# EAGLE design TouScrino-v1 (EAGLE 5.07)
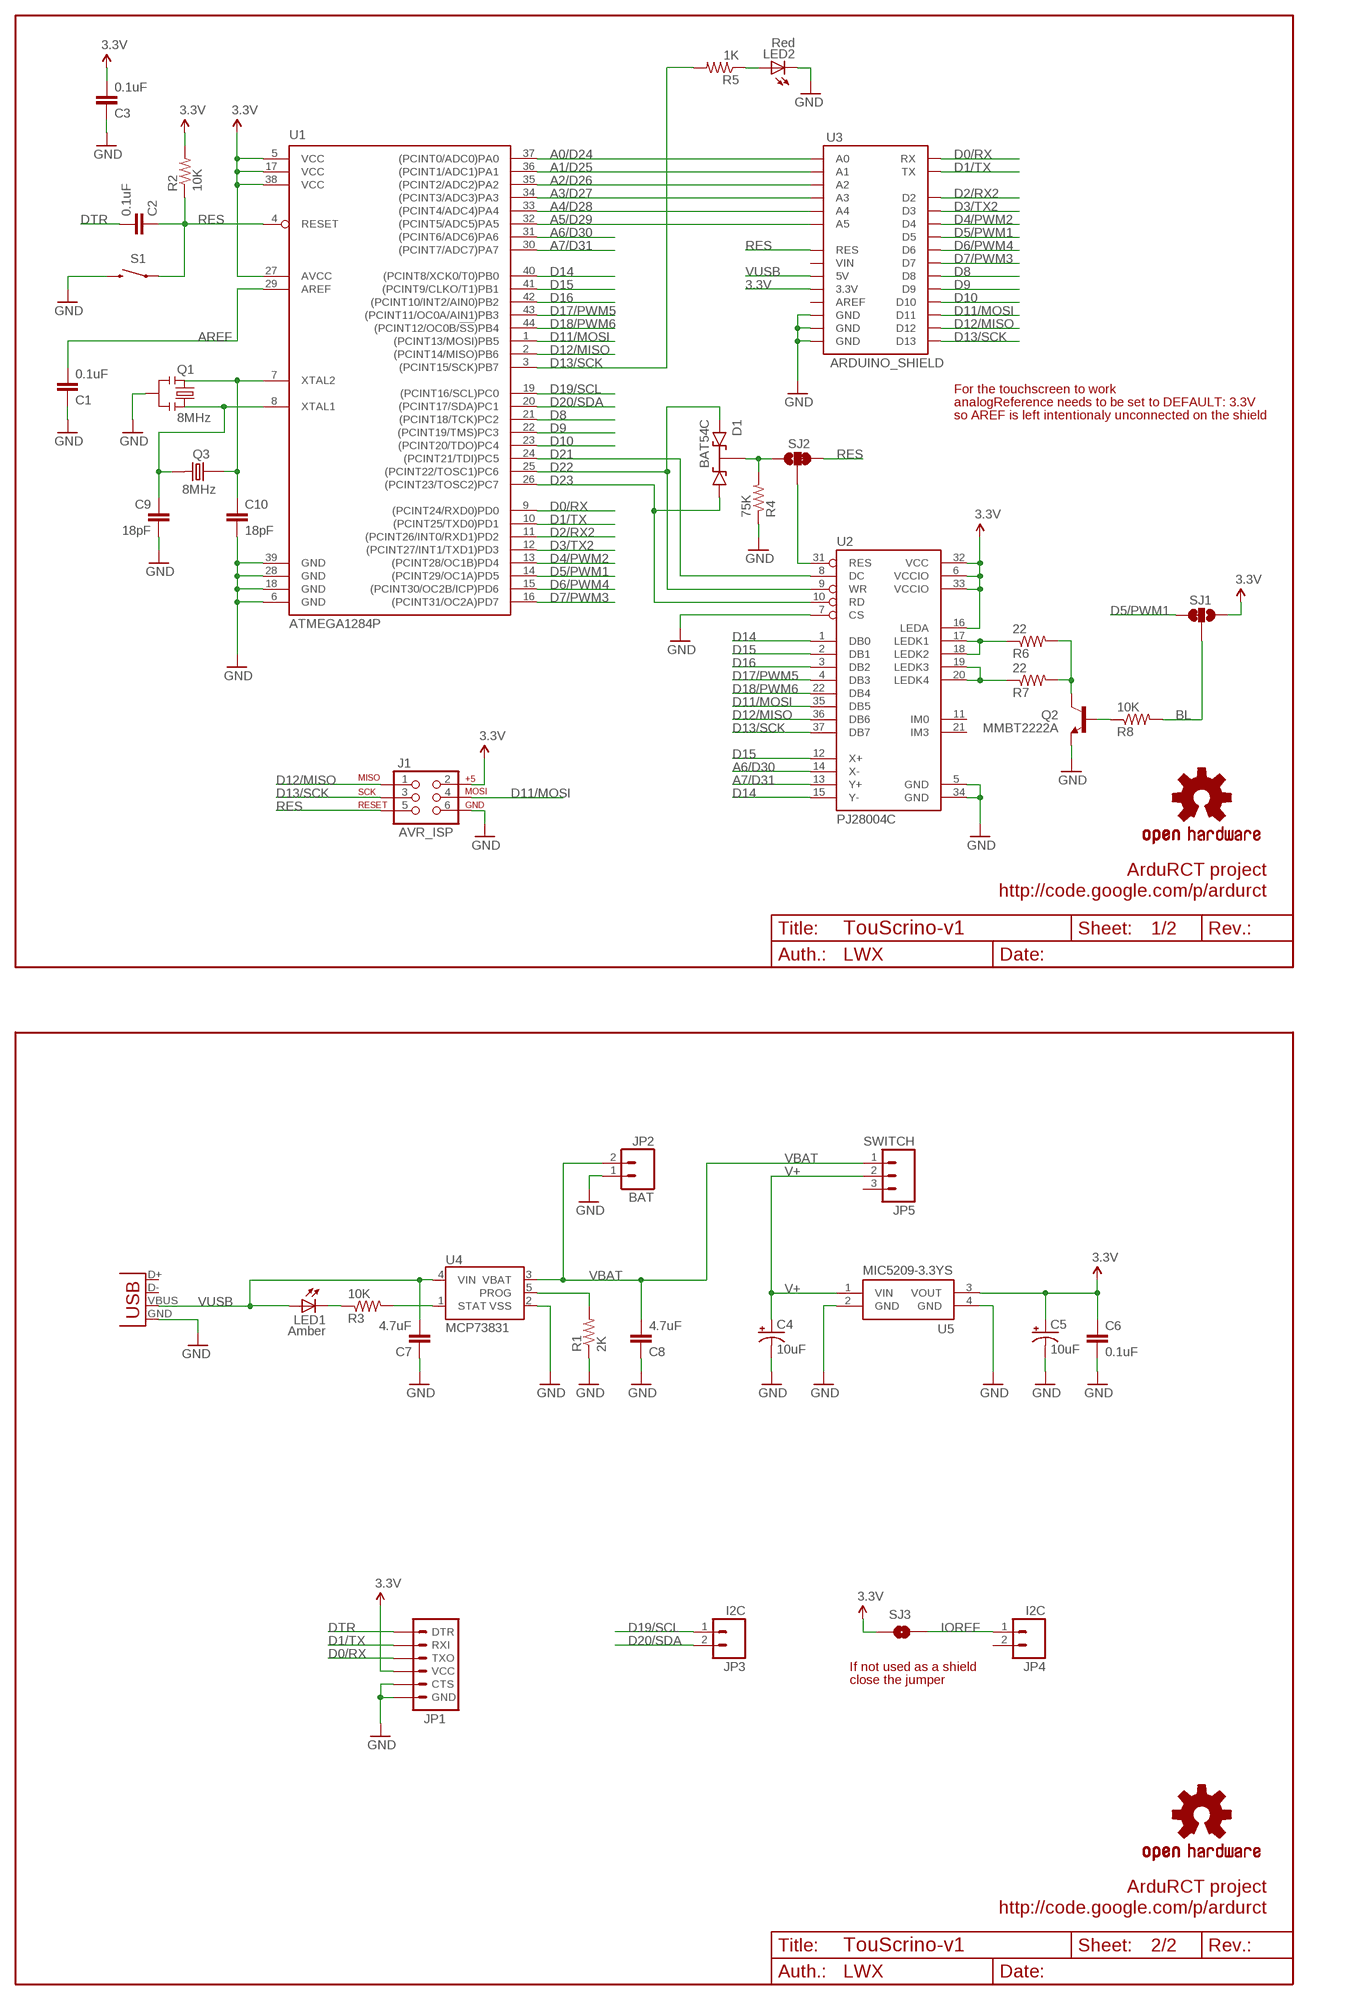
[diagram p0: schematic, sheet 1]

## Parts
C1  0.1uF  CAP0805  [0805]
C2  0.1uF  CAP0805  [0805]
C3  0.1uF  CAP0805  [0805]
C4  10uF  CAP_POL1206  [EIA3216]
C5  10uF  CAP_POL1206  [EIA3216]
C6  0.1uF  CAP0805  [0805]
C7  4.7uF  CAP0805  [0805]
C8  4.7uF  CAP0805  [0805]
C9  18pF  CAP0603-CAP  [0603-CAP]
C10  18pF  CAP0603-CAP  [0603-CAP]
D1  BAT54C  [SOT23-3]
J1  AVR_ISP  AVR_SPI_PRG_6PTH  [2X3]
JP1  ARDUINO_SERIAL_PROGRAMPTH  [1X06]
JP2  BAT  M02-JST-2MM-SMT  [JST-2-SMD]
JP3  I2C  M02  [1X02]
JP4  I2C  M02  [1X02]
JP5  SWITCH  M03  [1X3_LONGPAD]
LED1  Amber  LED  [LED]
LED2  Red  LED805  [LED-0805]
Q1  8MHz  RESONATORSMD  [RESONATOR-SMD]
Q2  MMBT2222A  TRANSISTOR_NPNSOT23-3  [SOT23-3]
Q3  8MHz  CRYSTAL_5X3.2  [CRYSTAL_5X3.2]
R1  2K  RESISTOR0805-RES  [0805]
R2  10K  RESISTOR0805-RES  [0805]
R3  10K  RESISTOR0805-RES  [0805]
R4  75K  RESISTOR0805-RES  [0805]
R5  1K  RESISTOR0805-RES  [0805]
R6  22  RESISTOR0805-RES  [0805]
R7  22  RESISTOR0805-RES  [0805]
R8  10K  RESISTOR0805-RES  [0805]
S1  SWITCH-MOMENTARY-2SMD  [TACTILE_SWITCH_SMD]
SJ1  SJ_2WAYS_1-2  [SJ_2WAYS_1-2_S]
SJ2  SJ_2WAYS_1-2  [SJ_2WAYS_1-2_S]
SJ3  SOLDERJUMPERNO  [SJ_2S-NO]
U1  ATMEGA1284P  ATMEGA324A  [TQFP44]
U2  PJ28004C  [PJ28004C]
U3  ARDUINO_SHIELD  [ARDUINO_SHIELD]
U4  MCP73831  [SOT23-5]
U5  MIC5209-3.3YS  MIC5209  [SOT223]
U$3  OSHW-LOGOM  [OSHW-LOGO-M]
U$5  OSHW-LOGOM  [OSHW-LOGO-M]
X1  USBSMD  [USB-MINIB]

## Nets
3.3V: C3.2 C5.A(+) C6.1 J1.2 JP1.4(VCC) R2.2 SJ1.3 SJ3.1 U1.5(VCC) U1.17(VCC) U1.27(AVCC) U1.38(VCC) U2.6(VCCIO) U2.16(LEDA) U2.32(VCC) U2.33(VCCIO) U3.3.3V U5.3(VOUT)
A0/D24: U1.37((PCINT0/ADC0)PA0) U3.A0
A1/D25: U1.36((PCINT1/ADC1)PA1) U3.A1
A2/D26: U1.35((PCINT2/ADC2)PA2) U3.A2
A3/D27: U1.34((PCINT3/ADC3)PA3) U3.A3
A4/D28: U1.33((PCINT4/ADC4)PA4) U3.A4
A5/D29: U1.32((PCINT5/ADC5)PA5) U3.A5
A6/D30: U1.31((PCINT6/ADC6)PA6) U2.14(X-)
A7/D31: U1.30((PCINT7/ADC7)PA7) U2.13(Y+)
AREF: C1.2 U1.29(AREF)
BL: R8.2 SJ1.2
D0/RX: JP1.3(TXO) U1.9((PCINT24/RXD0)PD0) U3.RX
D1/TX: JP1.2(RXI) U1.10((PCINT25/TXD0)PD1) U3.TX
D2/RX2: U1.11((PCINT26/INT0/RXD1)PD2) U3.D2
D3/TX2: U1.12((PCINT27/INT1/TXD1)PD3) U3.D3
D4/PWM2: U1.13((PCINT28/OC1B)PD4) U3.D4
D5/PWM1: SJ1.1 U1.14((PCINT29/OC1A)PD5) U3.D5
D6/PWM4: U1.15((PCINT30/OC2B/ICP)PD6) U3.D6
D7/PWM3: U1.16((PCINT31/OC2A)PD7) U3.D7
D8: U1.21((PCINT18/TCK)PC2) U3.D8
D9: U1.22((PCINT19/TMS)PC3) U3.D9
D10: U1.23((PCINT20/TDO)PC4) U3.D10
D11/MOSI: J1.4 U1.1((PCINT13/MOSI)PB5) U2.35(DB5) U3.D11
D12/MISO: J1.1 U1.2((PCINT14/MISO)PB6) U2.36(DB6) U3.D12
D13/SCK: J1.3 R5.2 U1.3((PCINT15/SCK)PB7) U2.37(DB7) U3.D13
D14: U1.40((PCINT8/XCK0/T0)PB0) U2.1(DB0) U2.15(Y-)
D15: U1.41((PCINT9/CLKO/T1)PB1) U2.2(DB1) U2.12(X+)
D16: U1.42((PCINT10/INT2/AIN0)PB2) U2.3(DB2)
D17/PWM5: U1.43((PCINT11/OC0A/AIN1)PB3) U2.4(DB3)
D18/PWM6: U1.44((PCINT12/OC0B/!SS!)PB4) U2.22(DB4)
D19/SCL: JP3.1 U1.19((PCINT16/SCL)PC0)
D20/SDA: JP3.2 U1.20((PCINT17/SDA)PC1)
D21: U1.24((PCINT21/TDI)PC5) U2.8(DC)
D22: D1.2(A2) U1.25((PCINT22/TOSC1)PC6) U2.9(WR)
D23: D1.1(A1) U1.26((PCINT23/TOSC2)PC7) U2.10(RD)
DTR: C2.2 JP1.1(DTR)
GND [vcc]: C1.1 C3.1 C4.C(-) C5.C(-) C6.2 C7.1 C8.1 C9.2 C10.2 J1.6 JP1.5(CTS) JP1.6(GND) JP2.1 LED2.2(C) Q1.2 Q2.2(E) R1.1 R4.1 S1.3 U1.6(GND) U1.18(GND) U1.28(GND) U1.39(GND) U2.5(GND) U2.7(CS) U2.34(GND) U3.GND@0(GND) U3.GND@1(GND) U3.GND@2(GND) U4.2(VSS) U5.2(GND) U5.4(GND) X1.GND
IOREF: JP4.1 SJ3.2
LCD_RES: SJ2.2 U2.31(RES)
N$1: C9.1 Q1.1 Q3.2 U1.8(XTAL1)
N$2: C10.1 Q1.3 Q3.1 U1.7(XTAL2)
N$4: Q2.1(B) R8.1
N$5: LED2.1(A) R5.1
N$7: Q2.3(C) R6.2 R7.2
N$8: LED1.C1(C) R3.1
N$9: D1.3(K) R4.2 SJ2.3
N$12: R3.2 U4.1(STAT)
N$13: R1.2 U4.5(PROG)
N$25: R7.1 U2.19(LEDK3) U2.20(LEDK4)
N$32: R6.1 U2.17(LEDK1) U2.18(LEDK2)
RES: C2.1 J1.5 R2.1 S1.1 SJ2.1 U1.4(RESET) U3.RES
V+: C4.A(+) JP5.2 U5.1(VIN)
VBAT: C8.2 JP2.2 JP5.1 U4.3(VBAT)
VUSB: C7.2 LED1.A1(A) U3.5V U4.4(VIN) X1.VBUS
Unconnected: JP4.2 JP5.3 U2.11(IM0) U2.21(IM3) U3.AREF U3.VIN X1.D+ X1.D-

## Notes on the sheet
- For the touchscreen to work
- analogReference needs to be set to DEFAULT: 3.3V
- so AREF is left intentionaly unconnected on the shield
- ArduRCT project
- http://code.google.com/p/ardurct
- 1/2
- LWX
- If not used as a shield
- close the jumper
- ArduRCT project
- http://code.google.com/p/ardurct
- 2/2
- LWX

## Library data of the parts
C1-C3 C6-C10 = SparkFun:CAP: Capacitor Standard 0603 ceramic capacitor, and 0.1" leaded capacitor.
C4 C5 = SparkFun:CAP_POL: Capacitor Polarized These are standard SMD and PTH capacitors. Normally 10uF, 47uF, and 100uF in electrolytic and tantalum varieties. Always verify the external diameter of the through hole cap, it varies with capacity, voltage, and manufacturer. The EIA devices should be standard.
D1 = wibauxl:BAT54C
J1 = SparkFun:AVR_SPI_PRG_6: AVR ISP 6 Pin This is the reduced ISP connector for AVR programming. Common on Arduino. This footprint will take up less PCB space and can be used with a 10-pin to 6-pin adapter such as SKU: BOB-08508
JP1 = SparkFun:ARDUINO_SERIAL_PROGRAM
JP2 = SparkFun:M02: Header 2 Standard 2-pin 0.1" header. Use with straight break away headers (SKU : PRT-00116), right angle break away headers (PRT-00553), swiss pins (PRT-00743), machine pins (PRT-00117), and female headers (PRT-00115). Molex polarized connector foot print use with SKU : PRT-08233 with associated crimp pins and housings.
JP3 JP4 = wibauxl:M02
JP5 = wibauxl:M03
LED1 LED2 = wibauxl:LED
Q1 = SparkFun:RESONATOR: Resonator Small SMD resonator. This is the itty bitty 10/20MHz resonators with built in caps. CSTCE10M0G55 and CSTCE20M0V53. Footprint has been reviewed closely but hasn't been tested yet.
Q2 = SparkFun:TRANSISTOR_NPN: Transistor NPN BJT configuration in SOT23 package. MMBT2222 is the common NPN we use. Double check BCE configuration again layout.
Q3 = wibauxl:CRYSTAL_5X3.2
R1-R8 = SparkFun:RESISTOR: Resistor Basic schematic elements and footprints for 0603, 1206, and PTH resistors.
S1 = SparkFun:SWITCH-MOMENTARY-2
SJ1 SJ2 = wibauxl:SJ_2WAYS_1-2
SJ3 = SparkFun:SOLDERJUMPER: Solder Jumper Standard SMD solder jumper. Used to automate production. Two varients : Normally Open and Normally Closed are the same, but have different paste layers. NC will have a large amount of paste and should jumper during reflow.
U1 = wibauxl:ATMEGA324: 8-bit Microcontroller with 64K Bytes In-System Programmable Flash Source: http://www.atmel.com/dyn/resources/prod_documents/doc2593.pdf
U2 = wibauxl:PJ28004C
U3 = wibauxl:ARDUINO_SHIELD
U4 = SparkFun:MCP73831: Microchip's MCP73831 Miniature single cell, fully integrated Li-Ion, Li-polymer charge management controller http://ww1.microchip.com/downloads/en/DeviceDoc/21984a.pdf
U5 = wibauxl:MIC5209
U$3 U$5 = SparkFun:OSHW-LOGO: Open Source Hardware Logo This logo indicates the piece of hardware it is found on incorporates a OSHW license and/or adheres to the definition of open source hardware found here: http://freedomdefined.org/OSHW
X1 = SparkFun:USB: USB Connectors USB-B-PTH is fully proven SKU : PRT-00139 USB-miniB is fully proven SKU : PRT-00587 USB-A-PCB is untested. USB-A-H is throughly reviewed, but untested. Spark Fun Electronics SKU : PRT-00437 USB-B-SMT is throughly reviewed, but untested. Needs silkscreen touching up. USB-A-S has not been used/tested USB-MB-H has not been used/tested

## Net classes
0 default: width 0.203 mm
1 vcc: width 0.254 mm

## Board
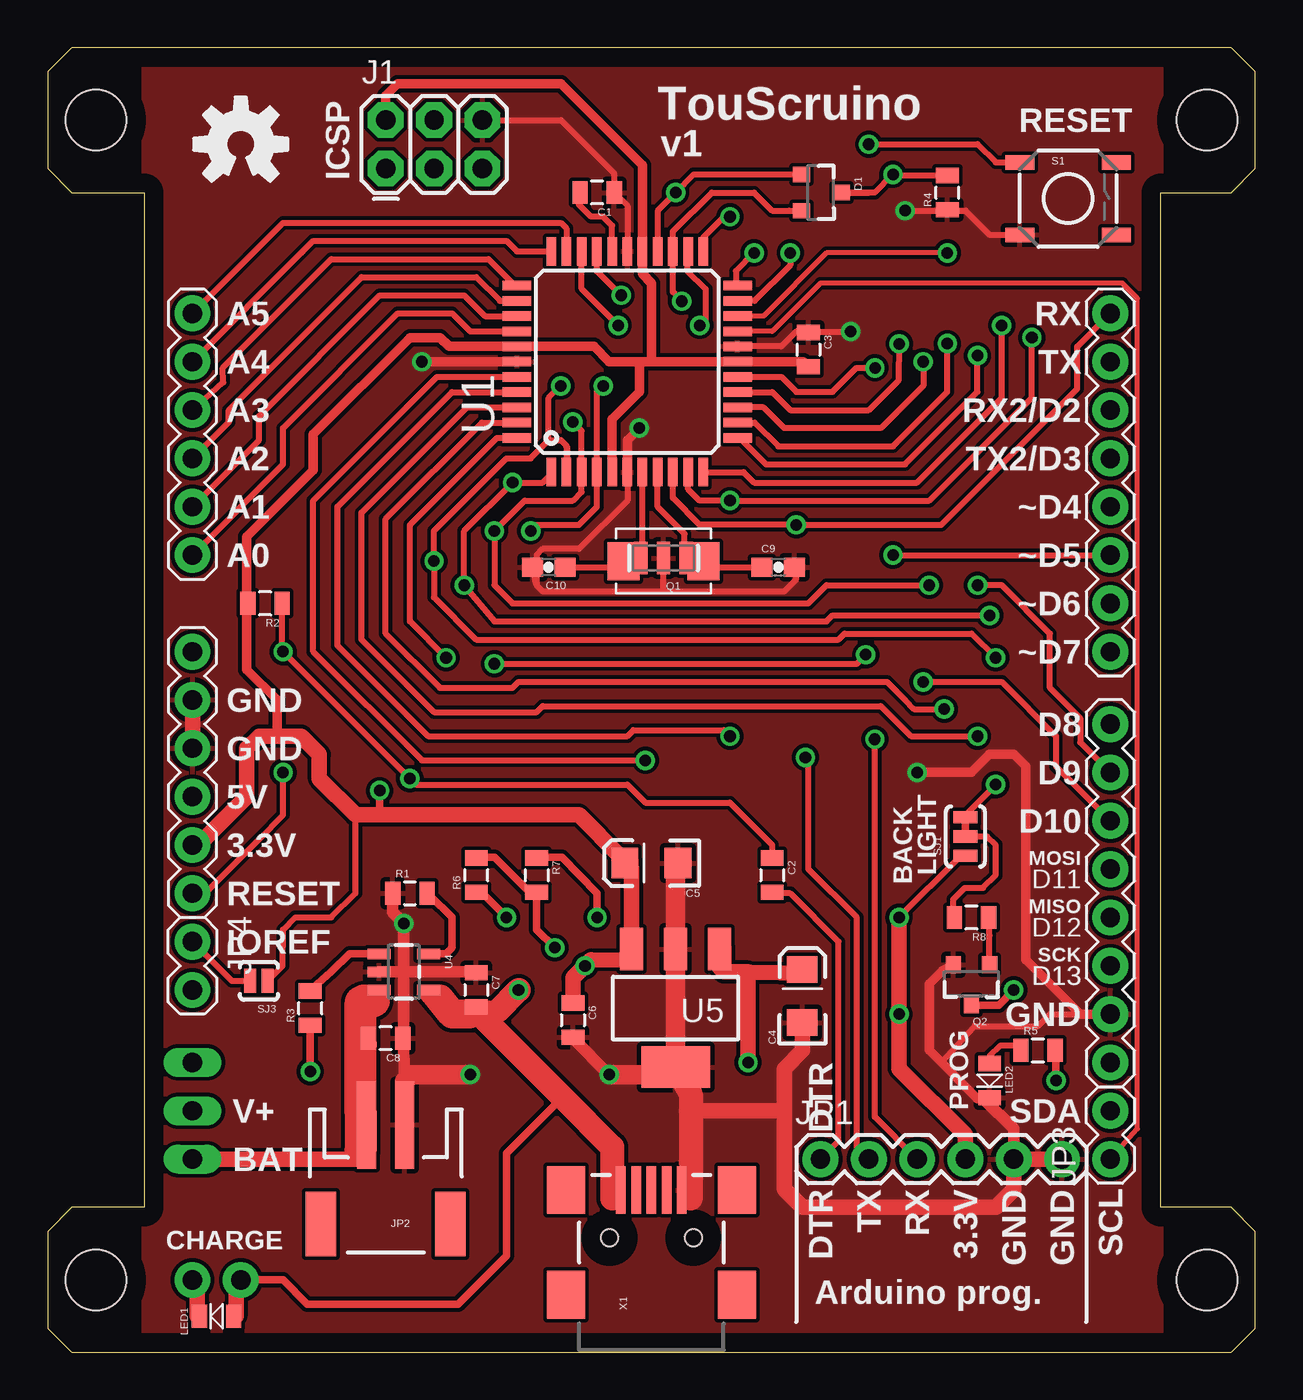
[diagram p1: board, top side]
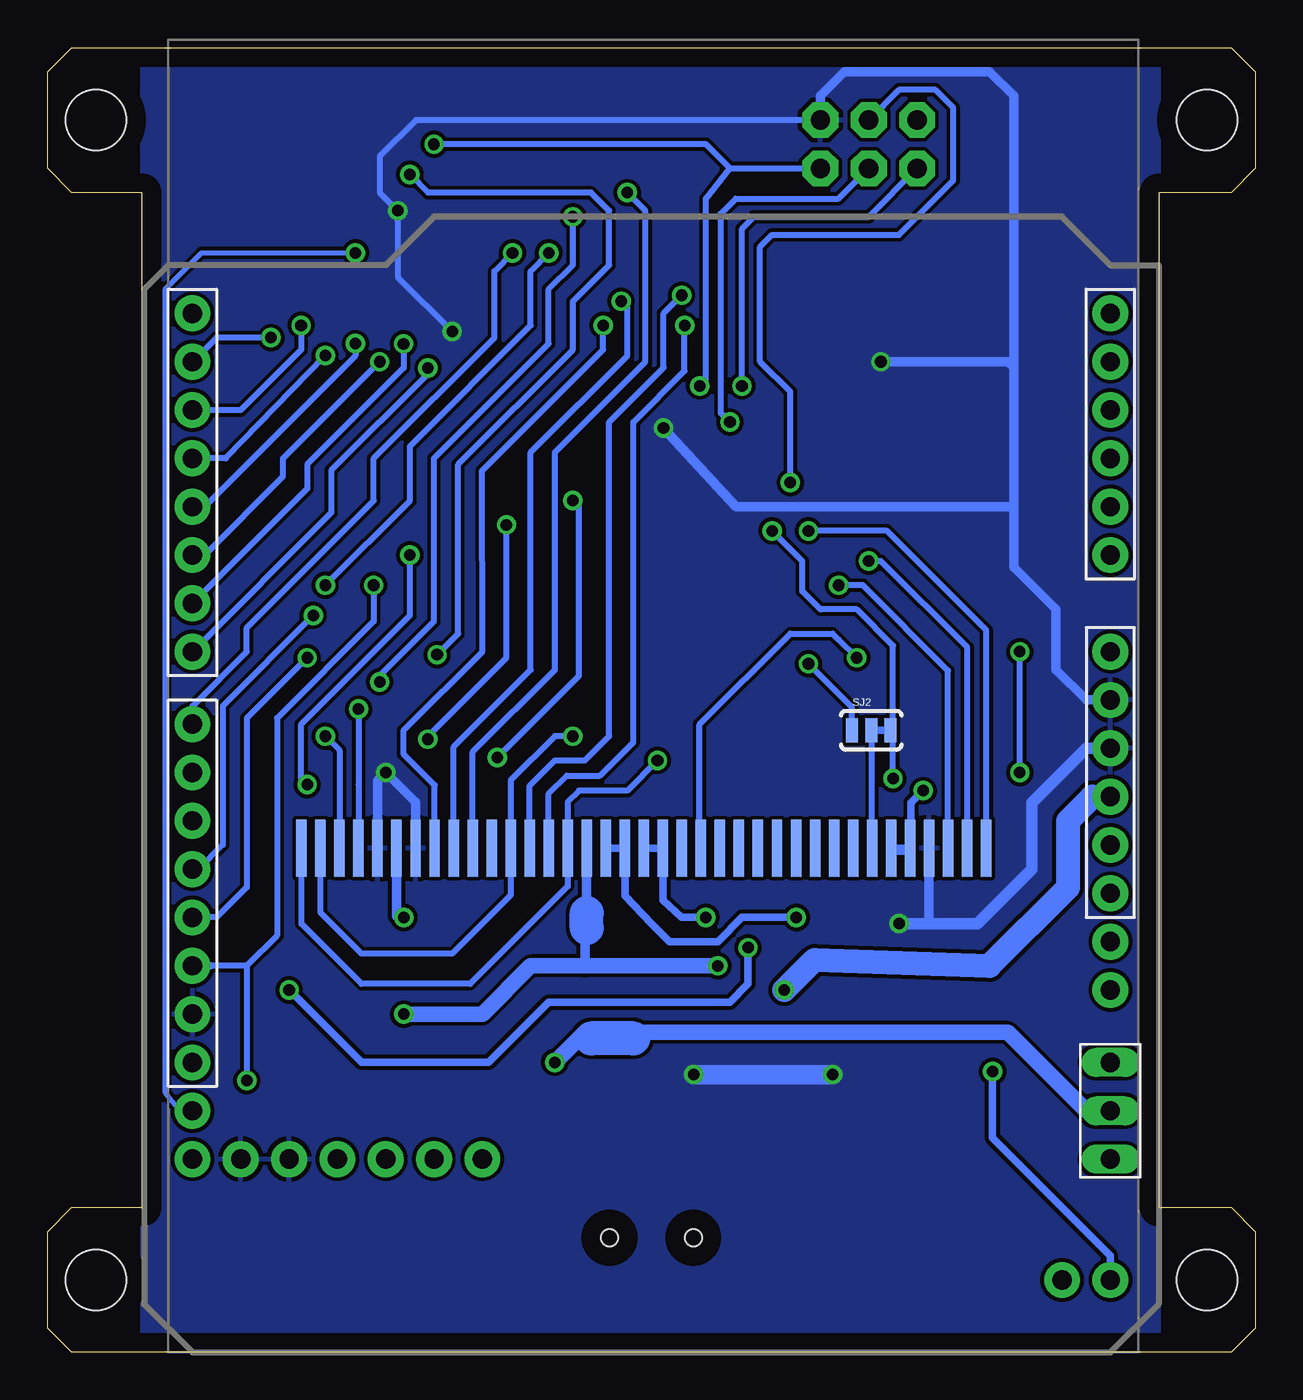
[diagram p2: board, bottom side, seen from below]

Size 63.5 x 68.58 mm. Coordinates in mm from the lower left corner, seen from the top.
Outline: 63.5,1.27 63.5,6.35 62.23,7.62 58.52,7.62 58.52,60.96 62.23,60.96 63.5,62.23 63.5,67.31 62.23,68.58 1.27,68.58 0,67.31 0,62.23 1.27,60.96 5.08,60.96 5.08,7.62 1.27,7.62 0,6.35 0,1.27 1.27,0 62.23,0 63.5,1.27
Copper layers (1*16): Top 0.035mm / dielectric 1.5mm / Bottom 0.035mm
Design rules "default": minimum track width 10mil, minimum drill 24mil, track to track 8mil, track to pad 8mil, pad to pad 8mil, via to via 8mil, smd to smd 8mil, copper to edge 40mil, drill to drill 8mil, minimum pad ring 10mil, minimum via ring 8mil, stop-mask expansion 4mil, vias tented up to drill 0mil, thermal gap 10mil
Holes 3.2 mm at 2.54,64.77 60.96,64.77 2.54,3.81 60.96,3.81

### Footprints (pad centres in the part's own frame; a part is rotated, then mirrored left to right if it is on the bottom)
0805 = smd 0.8 x 1.2: 1 -0.9,0; 2 0.9,0
EIA3216 = smd 1.4 x 1.6: A 1.4,0; C -1.4,0
0603-CAP = smd 1.1 x 1: 1 -0.85,0; 2 0.85,0
SOT23-3 = smd 0.8 x 0.9: 1 -0.95,-1; 2 0.95,-1; 3 0,1.1
2X3 = drill 1.016 pad 1.88 octagon: 1 0,0; 2 0,2.54; 3 2.54,0; 4 2.54,2.54; 5 5.08,0; 6 5.08,2.54
1X06 = drill 1.016 pad 1.88 round: 1 0,0; 2 2.54,0; 3 5.08,0; 4 7.62,0; 5 10.16,0; 6 12.7,0
JST-2-SMD = smd 1 x 4.6: 1 -1,-3.7; 2 1,-3.7 | smd 1.6 x 3.4: NC1 -3.4,1.5; NC2 3.4,1.5
1X02 = drill 1.016 pad 1.88 round: 1 0,0; 2 2.54,0
1X3_LONGPAD = drill 1.016 pad 1.245 long: 1 0,0; 2 -2.54,0; 3 -5.08,0
LED = smd 0.8 x 1.2: A -0.9,0; C 0.9,0 | drill 1.016 pad 1.88 round: A1 -1.27,-1.905; C1 1.27,-1.905
LED-0805 = smd 0.8 x 1.2: 1 -0.9,0; 2 0.9,0
RESONATOR-SMD = smd 0.7 x 1.7: 1 -1.2,0; 2 0,0; 3 1.2,0
CRYSTAL_5X3.2 = smd 1.7 x 2: 1 2.1,0; 2 -2.1,0
TACTILE_SWITCH_SMD = smd 1.524 x 0.762: 1 -2.54,1.905; 2 2.54,1.905; 3 -2.54,-1.905; 4 2.54,-1.905
SJ_2WAYS_1-2_S = smd 0.635 x 1.27: 1 0.508,0; 2 -0.508,0; 3 -1.524,0
SJ_2S-NO = smd 0.635 x 1.27: 1 -0.45,0; 2 0.45,0
TQFP44 = smd 1.5 x 0.5: 1 -5.8,4; 2 -5.8,3.2; 3 -5.8,2.4; 4 -5.8,1.6; 5 -5.8,0.8; 6 -5.8,0; 7 -5.8,-0.8; 8 -5.8,-1.6; 9 -5.8,-2.4; 10 -5.8,-3.2; 11 -5.8,-4; 23 5.8,-4; 24 5.8,-3.2; 25 5.8,-2.4; 26 5.8,-1.6; 27 5.8,-0.8; 28 5.8,0; 29 5.8,0.8; 30 5.8,1.6; 31 5.8,2.4; 32 5.8,3.2; 33 5.8,4 | smd 0.5 x 1.5: 12 -4,-5.8; 13 -3.2,-5.8; 14 -2.4,-5.8; 15 -1.6,-5.8; 16 -0.8,-5.8; 17 0,-5.8; 18 0.8,-5.8; 19 1.6,-5.8; 20 2.4,-5.8; 21 3.2,-5.8; 22 4,-5.8; 34 4,5.8; 35 3.2,5.8; 36 2.4,5.8; 37 1.6,5.8; 38 0.8,5.8; 39 0,5.8; 40 -0.8,5.8; 41 -1.6,5.8; 42 -2.4,5.8; 43 -3.2,5.8; 44 -4,5.8
PJ28004C = smd 0.55 x 3: 1 7,26.5; 2 8,26.5; 3 9,26.5; 4 10,26.5; 5 11,26.5; 6 12,26.5; 7 13,26.5; 8 14,26.5; 9 15,26.5; 10 16,26.5; 11 17,26.5; 12 18,26.5; 13 19,26.5; 14 20,26.5; 15 21,26.5; 16 22,26.5; 17 23,26.5; 18 24,26.5; 19 25,26.5; 20 26,26.5; 21 27,26.5; 22 28,26.5; 23 29,26.5; 24 30,26.5; 25 31,26.5; 26 32,26.5; 27 33,26.5; 28 34,26.5; 29 35,26.5; 30 36,26.5; 31 37,26.5; 32 38,26.5; 33 39,26.5; 34 40,26.5; 35 41,26.5; 36 42,26.5; 37 43,26.5
ARDUINO_SHIELD = drill 1.016 pad 1.88 round: 3.3V 33.02,50.8; 5V 30.48,50.8; A0 17.78,50.8; A1 15.24,50.8; A2 12.7,50.8; A3 10.16,50.8; A4 7.62,50.8; A5 5.08,50.8; AREF 44.45,2.54; D2 10.16,2.54; D3 12.7,2.54; D4 15.24,2.54; D5 17.78,2.54; D6 20.32,2.54; D7 22.86,2.54; D8 26.67,2.54; D9 29.21,2.54; D10 31.75,2.54; D11 34.29,2.54; D12 36.83,2.54; D13 39.37,2.54; GND@0 27.94,50.8; GND@1 25.4,50.8; GND@2 41.91,2.54; RES 35.56,50.8; RX 5.08,2.54; TX 7.62,2.54; VIN 22.86,50.8
SOT23-5 = smd 0.55 x 1.2: 1 -0.95,-1.3; 2 0,-1.3; 3 0.95,-1.3; 4 0.95,1.3; 5 -0.95,1.3
SOT223 = smd 1.219 x 2.235: 1 -2.311,-3.099; 2 0,-3.099; 3 2.311,-3.099 | smd 3.6 x 2.2: 4 0,3.099
USB-MINIB = smd 2.5 x 0.5: D+ 2.5,0; D- 2.5,0.8; GND 2.5,-1.6; ID 2.5,-0.8; VBUS 2.5,1.6 | smd 2.5 x 2: MTN1 -3,4.5; MTN2 2.5,4.5; MTN3 -3,-4.5; MTN4 2.5,-4.5 | hole 0.9: 0,2.2; 0,-2.2

### Placement (x,y rotation side)
C1  28.89,60.96 180 top
C2  38.1,25.08 270 top
C3  40.01,52.7 270 top
C4  39.69,18.73 90 top
C5  31.75,25.72 180 top
C6  27.62,17.46 270 top
C7  22.54,19.05 270 top
C8  17.78,16.51 180 top
C9  38.42,41.27 0 top
C10  26.35,41.27 180 top
D1  40.64,60.96 270 top
J1  17.78,62.23 0 top
JP1  40.64,10.16 0 top
JP2  17.78,8.26 180 top
JP3  55.88,10.16 90 top
JP4  7.62,21.59 270 top
JP5  7.62,10.16 270 bottom
LED1  8.89,1.91 180 top
LED2  49.53,14.29 270 top
Q1  32.38,41.75 180 top
Q2  48.58,19.37 180 top
Q3  32.38,41.59 180 top
R1  19.05,24.13 0 top
R2  11.43,39.37 180 top
R3  13.81,18.1 90 top
R4  47.31,60.96 90 top
R5  52.07,15.88 0 top
R6  22.54,25.08 90 top
R7  25.72,25.08 270 top
R8  48.58,22.86 180 top
S1  53.66,60.64 0 top
SJ1  48.26,27.62 90 top
SJ2  19.68,32.7 0 bottom
SJ3  11.11,19.53 180 top
U1  30.48,52.07 90 top
U2  57.15,0 0 bottom
U3  58.42,59.69 270 bottom
U4  18.73,20 270 top
U5  33.02,18.1 180 top
U$3  10.16,63.5 0 top
U$5  10.16,63.5 0 top
X1  31.75,6.03 90 top

### Tracks (layer width: path | path; a pad name or v marks a point on that pad's centre or on a via)
3.3V  (via drill 0.61)
  Top 0.305: 39.74,52.07 C3.2 | 31.28,61.91 31.33,61.86 | 31.28,61.43 31.28,62.23 | v44.77,22.86 47.94,26.04 | 10.48,39.37 R2.2 | 16.19,28.26 16.19,24.13 14.92,22.86 13.02,22.86 12.38,22.23 12.36,20.32 SJ3.1
  Top 0.406: 17.46,28.26 v17.46,29.53 | 47.94,26.04 SJ1.3
  Top 0.508: 31.75,52.07 U1.17 39.74,52.07 | 31.75,52.07 31.75,56.2 31.28,56.68 U1.27 31.28,61.43 31.28,61.91 31.28,62.23 31.28,62.38 26.99,66.67 18.41,66.67 17.78,66.04 J1.2 | 31.11,52.07 29.53,52.07 28.73,52.87 U1.38 21.12,52.87 20.64,53.34 19.05,53.34 13.97,48.26 13.97,46.35 10.48,42.86 10.48,39.37 10.48,35.88 12.06,34.29 12.06,32.38 | 31.11,52.07 31.75,52.07 | U1.5 29.68,49.05 31.11,50.48 31.11,52.07
  Top 0.61: U5.3 30.47,20.95
  Top 0.813: C6.1 27.62,19.68 v28.26,20.32 28.57,20.64 30.47,20.62 30.47,20.95 | U5.3 30.71,25.17 30.67,25.85 C5.A 30.48,26.04 30.16,26.04 27.94,28.26 17.46,28.26 16.19,28.26 14.29,30.16 14.29,31.43 13.34,32.38 12.06,32.38 11.11,32.38 10.48,31.75 10.48,29.21 7.94,26.67 U3.3.3V | JP1.4 48.26,11.43 44.77,14.92 v44.77,17.78 v44.77,22.86
  Bottom 0.305: U2.33 U2.32
  Bottom 0.406: U2.33 18.9,26.5 19.05,26.35 18.1,26.35 18.1,28.89 v17.46,29.53
  Bottom 0.508: U2.6 45.15,22.93 v44.77,22.86 | 35.15,23.09 U2.16 | 35.15,22.32 35.24,21.91 35.24,20.32
  Bottom 0.813: v28.26,20.32 35.24,20.32 38.1,20.32 40.64,17.78 v44.77,17.78
  Bottom 1.778: 35.15,22.32 35.15,23.09
A0/D24
  Top 0.305: U1.37 22.23,53.66 21.27,54.61 18.41,54.61 12.38,48.58 12.38,46.67 U3.A0
A1/D25
  Top 0.305: U1.36 23,54.47 21.91,55.56 17.46,55.56 11.11,49.21 11.11,47.94 U3.A1
A2/D26
  Top 0.305: U1.35 23.79,55.27 22.54,56.52 16.51,56.52 9.53,49.53 9.53,48.9 U3.A2
A3/D27
  Top 0.305: U1.34 24.57,56.07 23.18,57.47 14.92,57.47 9.21,51.75 9.24,50.99 U3.A3
A4/D28
  Top 0.305: U1.33 24.68,57.87 24.13,58.42 13.97,58.42 13.42,57.87 13.34,57.78 U3.A4
A5/D29
  Top 0.305: U1.32 27.28,59.08 26.99,59.37 12.38,59.37 U3.A5
A6/D30  (via drill 0.61)
  Top 0.305: U1.31 28.08,55.9 v30,53.98
  Bottom 0.305: U2.14 37.15,29.37 36.2,30.32 34.45,30.32 32.7,32.07 32.7,48.9 30,51.59 v30,53.98
A7/D31  (via drill 0.61)
  Top 0.305: U1.30 28.88,56.82 v30.16,55.56
  Bottom 0.305: U2.13 38.15,29.8 36.83,31.11 35.24,31.11 33.97,32.38 33.97,48.9 31.11,51.75 31.11,54.61 v30.16,55.56
AREF
  Top 0.305: U1.29 29.68,59.22 29.21,59.69 28.57,59.69 27.94,60.33 27.94,60.91 C1.2
BL
  Top 0.305: SJ1.2 49.4,27.11 49.85,26.67 49.85,25.08 49.18,24.42 48.23,24.42 47.62,23.81 47.62,23.23 R8.2
D0/RX  (via drill 0.61)
  Top 0.305: U1.9 32.88,44.91 34.29,43.5 v39.37,43.5 46.99,43.5 54.13,50.64 54.13,52.86 U3.RX | JP1.3 43.5,12.38 v43.5,32.23
  Bottom 0.305: v43.5,32.23 43.5,32.38 39.37,36.51 v39.37,43.5
D1/TX  (via drill 0.61)
  Top 0.305: U1.10 33.68,45.38 34.29,44.77 v35.88,44.77 46.35,44.77 51.75,50.16 v51.75,53.34 | v39.85,31.27 40.01,31.11 40.01,25.4 42.55,22.86 42.55,10.79 JP1.2
  Bottom 0.305: v39.85,31.27 35.56,35.56 35.56,44.45 v35.88,44.77 | v51.75,53.34 54.61,53.34 U3.TX
D2/RX2  (via drill 0.61)
  Top 0.305: v50.16,53.98 50.16,50.16 45.72,45.72 37.15,45.72 36.6,46.27 U1.11
  Bottom 0.305: v50.16,53.98 50.16,52.7 53.34,49.53 U3.D2
D3/TX2  (via drill 0.61)
  Top 0.305: v48.9,52.39 48.9,50.48 45.09,46.67 37.78,46.67 36.38,48.07 U1.12
  Bottom 0.305: v48.9,52.39 54.13,46.99 U3.D3
D4/PWM2  (via drill 0.61)
  Top 0.305: U1.13 37.17,48.87 38.42,47.62 44.45,47.62 47.31,50.48 v47.31,53.02
  Bottom 0.305: v47.31,53.02 47.31,52.39 55.24,44.45 U3.D4
D5/PWM1  (via drill 0.61)
  Top 0.305: v46.04,52.07 46.04,50.8 43.81,48.58 38.73,48.58 37.64,49.67 U1.14 | v44.45,41.91 U3.D5 | v49.85,29.84 48.26,28.23 SJ1.1
  Bottom 0.305: v46.04,52.07 51.12,46.99 51.12,46.04 55.24,41.91 U3.D5 | v44.45,41.91 44.45,38.73 50.16,33.02 50.16,30.16 v49.85,29.84
D6/PWM4  (via drill 0.61)
  Top 0.305: v44.78,53.01 44.76,51.1 43.18,49.53 39.05,49.53 38.11,50.47 U1.15
  Bottom 0.305: v44.78,53.01 44.78,51.74 49.85,46.67 49.85,45.4 U3.D6
D7/PWM3  (via drill 0.61)
  Top 0.305: v43.5,51.75 42.54,51.75 41.27,50.48 39.37,50.48 38.58,51.27 U1.16
  Bottom 0.305: v43.5,51.75 43.5,51.44 48.58,46.35 48.58,44.13 U3.D7
D8  (via drill 0.61)
  Top 0.305: U1.21 37.17,55.27 39.05,57.15 v39.05,57.78
  Bottom 0.305: U3.D8 55.88,33.97 53.02,36.83 53.02,38.1 46.35,44.77 46.35,46.99 40.01,53.34 40.01,56.83 v39.05,57.78
D9  (via drill 0.61)
  Top 0.305: U3.D9 54.29,32.07 54.29,33.34 52.7,34.92 52.7,37.78 50.16,40.32 v48.9,40.32 | v37.15,57.78 36.2,56.83 36.2,56.16 U1.22
  Bottom 0.305: v48.9,40.32 44.45,44.77 44.45,47.62 38.1,53.98 38.1,56.83 v37.15,57.78
D10  (via drill 0.61)
  Top 0.305: U1.23 34.48,58.61 35.56,59.69 v35.88,59.69 | U3.D10 53.02,30.8 53.02,32.38 50.16,35.24 v46.04,35.24
  Bottom 0.305: v35.88,59.69 35.88,57.15 37.15,55.88 37.15,53.02 43.18,46.99 43.18,38.42 46.04,35.56 v46.04,35.24
D11/MOSI  (via drill 0.61)
  Top 0.305: v49.53,38.73 41.27,38.73 40.96,38.42 23.5,38.42 v21.91,40.32 21.91,43.18 v24.45,45.72 26.04,45.72 26.39,46.08 26.39,46.35 U1.1
  Bottom 0.305: U3.D11 55.56,25.4 54.29,26.67 54.29,33.97 v49.53,38.73 | U2.35 16.15,35.84 20.64,40.32 v21.91,40.32 | J1.4 18.73,66.36 16.83,66.36 15.88,65.41 15.88,61.59 18.73,58.74 25.4,58.74 26.04,58.1 26.04,52.07 24.45,50.48 v24.45,45.72
D12/MISO  (via drill 0.61)
  Top 0.305: v49.85,36.51 48.58,37.78 41.91,37.78 41.59,37.47 22.54,37.47 20.32,39.69 v20.32,41.59 20.32,43.18 24.13,46.99 25.4,46.99 26.35,47.94 | 26.35,47.94 26.35,50.16 v26.99,50.8 | 27.3,47.62 27.3,46.3 U1.2 27.28,47.6 27.3,47.62 | 27.3,47.62 26.99,47.94 26.35,47.94
  Bottom 0.305: U2.36 15.15,37.06 19.68,41.59 v20.32,41.59 | U3.D12 54.61,22.86 53.02,24.45 53.02,33.34 v49.85,36.51 | v26.99,50.8 26.99,59.05 26.35,59.69 20.32,59.69 J1.1
D13/SCK  (via drill 0.61)
  Top 0.305: v46.35,40.32 40.96,40.32 40.01,39.37 24.45,39.37 23.5,40.32 v23.5,43.18 25.08,44.77 27.62,44.77 28.08,45.23 U1.3 28.08,48.44 v27.62,48.9
  Top 0.406: v53.02,14.29 53.02,15.88 R5.2
  Bottom 0.305: 53.02,20.32 51.44,21.91 51.44,33.34 46.35,38.42 v46.35,40.32 | U2.37 14.15,37.96 19.37,43.18 v23.5,43.18 | v27.62,48.9 28.1,49.37 28.1,59.85 27.3,60.64 21.91,60.64 J1.3 | 53.02,20.32 54.93,20.32 | 53.02,20.32 v53.02,14.29
  Bottom 0.406: 54.93,20.32 U3.D13
D14  (via drill 0.61)
  Top 0.305: U1.40 20.47,51.27 13.97,44.77 13.97,36.83 19.68,31.11 v31.43,31.11
  Bottom 0.305: U2.1 50.15,22.53 46.99,19.37 41.27,19.37 36.15,24.49 U2.15 36.15,28.94 35.56,29.53 33.02,29.53 v31.43,31.11
D15  (via drill 0.61)
  Top 0.305: v35.88,32.38 35.56,32.7 30.8,32.7 30.48,32.38 20,32.38 15.24,37.15 15.24,44.45 21.26,50.47 U1.41
  Bottom 0.305: U2.2 49.15,23.11 46.99,20.95 42.23,20.95 39.15,24.03 U2.12 39.15,30.07 36.83,32.38 v35.88,32.38
D16  (via drill 0.61)
  Top 0.305: v48.9,32.38 45.4,32.38 43.81,33.97 26.04,33.97 25.72,33.66 20.32,33.66 16.51,37.47 16.51,44.13 22.05,49.67 U1.42
  Bottom 0.305: U2.3 48.15,31.64 v48.9,32.38
D17/PWM5  (via drill 0.61)
  Top 0.305: v47.15,33.81 45.56,33.81 45.09,34.29 44.13,35.24 24.77,35.24 24.45,34.92 20.64,34.92 17.78,37.78 17.78,43.81 22.84,48.87 U1.43
  Bottom 0.305: U2.4 47.15,29.84 v47.15,33.81
D18/PWM6  (via drill 0.61)
  Top 0.305: v20.95,36.51 19.05,38.42 19.05,43.5 23.62,48.07 U1.44
  Bottom 0.305: U2.22 29.21,27.8 29.21,33.02 24.45,37.78 22.23,37.78 21.91,37.47 v20.95,36.51
D19/SCL
  Top 0.254: U1.19 38.11,53.67 40.64,56.2 56.52,56.2 57.31,55.4 57.31,11.75 JP3.1
D20/SDA  (via drill 0.61)
  Top 0.254: U1.20 37.64,54.47 40.96,57.78 v47.31,57.78
  Bottom 0.254: v47.31,57.78 55.4,57.78 57.31,55.88 57.31,13.65 56.52,12.7 JP3.2
D21  (via drill 0.61)
  Top 0.305: U1.24 33.66,56.83 34.61,55.88 34.61,54.29 v34.29,53.98
  Bottom 0.305: v34.29,53.98 34.29,52.7 40.66,46.34 40.64,36.83 44.77,32.7 44.77,31.43 43.15,29.82 U2.8
D22  (via drill 0.61)
  Top 0.305: v33.34,55.24 32.88,55.74 U1.25 32.88,58.91 34.92,60.96 37.15,60.96 38.1,60.01 39,60.01 D1.2
  Bottom 0.305: v33.34,55.24 33.02,54.93 33.02,52.39 38.1,47.31 38.1,35.88 42.15,31.83 U2.9
D23  (via drill 0.61)
  Top 0.305: U1.26 32.08,59.99 v33.02,60.96 33.97,61.91 39,61.91 D1.1
  Bottom 0.305: v33.02,60.96 32.07,60.01 32.07,52.07 36.83,47.31 36.83,35.88 41.15,31.56 U2.10
DTR
  Top 0.305: JP1.1 41.59,11.11 41.59,21.59 39.05,24.13 38.1,24.13 C2.2
GND  (via drill 0.61)
  Top 0.305: U1.6 30.48,44.77 27.94,42.23 26.04,42.23 25.72,41.91 25.72,40.32 | 33.81,8.1 X1.GND | v42.23,53.66 41.86,53.6 C3.1 39.95,53.66 39.37,53.66 38.58,52.87 U1.18 | 32.38,40.01 26.04,40.01 25.72,40.32 | U1.28 30.48,60.27 C1.1 29.79,61.97 26.99,64.77 J1.6 | 54.29,17.78 52.7,17.78 52.07,17.14 48.74,17.14 46.99,15.24 46.35,15.88 | LED2.2 49.58,13.34 | 46.35,15.88 | v45.09,60.01 46.67,60.01 | 46.67,60.01 R4.1 | 46.67,60.01 48.26,60.01 49.53,58.74 S1.3 | 32.38,40.01 Q1.2 | 32.38,40.01 38.73,40.01 39.37,40.64 39.37,41.17 C9.2 | 25.72,40.32 C10.2
  Top 0.406: 18.73,16.19 C8.1
  Top 0.508: U3.GND@2 54.29,17.78 51.44,20.64 51.44,23.81 51.44,30.8 50.8,31.43 49.53,31.43 48.58,30.48 v45.72,30.48 | v19.68,52.07 U1.39 | v31.11,48.58 30.48,47.94 U1.6 | Q2.2 47.04,20.05 46.35,19.37 46.35,15.88 48.9,13.34 LED2.2
  Top 0.61: 18.73,20 U4.2 | 18.78,14.24 18.73,15.88 18.73,16.19 18.73,20 | 21.91,20 C7.1 arc45 22.73,20 21.91,20 | C4.C 39.88,16.83 | C6.2 27.62,16.51 v29.53,14.61 | JP1.5 50.8,11.75 49.21,13.34 49.53,13.28 LED2.2 | 18.73,20 21.91,20 | 18.73,20 v18.73,22.54 18.15,23.12 R1.1
  Top 0.813: C5.C 33.02,25.59 U5.2 33.02,18.1 | 33.02,15.56 33.02,18.1 | 33.02,15.24 U5.4 | 33.02,18.1 33.05,14.63 | U3.GND@0 U3.GND@1 | JP1.6 JP1.5 50.8,8.57 49.85,7.62 39.69,7.62 38.73,8.57 38.73,12.7 | 38.73,12.7 38.73,14.92 39.69,15.88 C4.C | 33.83,12.7 38.73,12.7
  Top 1.016: JP2.1 18.78,14.24 19.1,14.61 v22.23,14.61 | 33.02,15.56 33.02,25.59 | 33.02,15.56 33.02,15.24 | v29.53,14.61 32.07,14.61 33.02,15.56
  Top 1.27: 33.81,8.1 33.83,9.99 33.83,12.7 33.83,13.56 U5.4
  Bottom 0.305: v42.23,53.66 45.09,56.52 v45.09,60.01 46.04,60.96 46.04,62.87 44.13,64.77 J1.6
  Bottom 0.508: 12.7,51.75 12.7,66.04 13.97,67.31 21.59,67.31 22.86,66.04 J1.6 | U2.34 17.15,22.55 18.41,22.54 | v31.11,48.58 27.3,44.45 12.7,44.45 | 12.7,44.45 12.7,51.75 | U3.GND@1 8.89,34.29 10.48,35.88 10.48,39.05 12.7,41.27 12.7,44.45 | v19.68,52.07 13.02,52.07 12.7,51.75 | U2.5 46.15,30.05 v45.72,30.48 44.15,28.91 U2.7
  Bottom 0.61: U3.GND@0 8.89,31.75 11.75,28.89 11.75,25.4 14.61,22.54 18.41,22.54 v18.73,22.54
  Bottom 1.016: v22.23,14.61 v29.53,14.61
  pour Top: 5.08,68.58 58.52,68.58 58.52,0 5.08,0
  pour Bottom: 5.08,68.58 58.52,68.58 58.52,0 5.08,0
IOREF
  Top 0.305: SJ3.2 9.68,19.53 JP4.1
LCD_RES
  Bottom 0.305: U2.31 20.15,32.66 SJ2.2
N$1
  Top 0.305: U1.8 32.08,44.44 33.5,43.02 33.5,42.46 Q1.1 33.74,41.59 Q3.2 34.8,41.27 C9.1
N$2
  Top 0.305: U1.7 31.28,42.39 31.11,42.23 31.11,41.66 Q1.3 31.03,41.59 Q3.1 29.97,41.27 C10.1
N$4
  Top 0.305: Q2.1 49.53,20.32 49.53,21.91 49.53,23.12 R8.1
N$5
  Top 0.305: LED2.1 49.53,15.56 50.11,16.14 51.12,16.14 R5.1
  Top 0.406: R5.1 51.06,15.82
N$7  (via drill 0.61)
  Top 0.305: 25.35,24.18 R7.2 25.98,24.18 | 22.28,26.04 R6.2
  Top 0.406: 25.35,24.18 23.5,26.04 22.28,26.04 | v26.67,21.27 25.72,22.23 R7.2 | v50.8,19.05 50.01,18.26 48.58,18.26 Q2.3
  Bottom 0.406: v26.67,21.27 26.67,19.37 27.62,18.41 37.15,18.41 40.32,15.24 46.99,15.24 v50.8,19.05
N$8  (via drill 0.61)
  Top 0.406: v13.81,14.76 R3.1
  Bottom 0.406: LED1.C1 7.62,5.08 13.81,11.27 v13.81,14.76
N$9  (via drill 0.61)
  Top 0.305: 43.5,60.96 D1.3 43.17,60.95 43.5,60.96 | 44.4,61.86 43.5,60.96 | 44.4,61.86 R4.2 | v23.5,36.2 42.55,36.2 v43.02,36.67 | v44.45,61.91 44.4,61.86
  Bottom 0.305: SJ2.3 21.21,33.91 v23.5,36.2 | v43.02,36.67 41.91,37.78 41.91,46.67 35.88,52.7 35.88,55.24 33.97,57.15 33.97,60.01 34.92,60.96 43.5,60.96 v44.45,61.91
N$12
  Top 0.406: 13.9,19.08 R3.2 13.97,19.16 14.92,20 15.87,20.95 U4.1
N$13
  Top 0.406: U4.5 20.95,20.95 21.2,21.2 arc45 21.27,21.38 21.27,22.86 20.12,24.01 arc45 20.03,24.05 R1.2
N$25  (via drill 0.61)
  Top 0.305: R7.1 25.72,26.04
  Top 0.406: v28.89,22.86 28.89,24.13 27.04,26.04 25.72,26.04
  Bottom 0.406: U2.19 U2.20 31.15,23.78 30.16,22.86 v28.89,22.86
N$32  (via drill 0.61)
  Top 0.305: R6.1 22.86,24.13
  Top 0.406: 22.86,24.13 v24.13,22.86
  Bottom 0.406: U2.17 U2.18 33.15,24 31.75,22.54 30.8,21.59 28.26,21.59 26.99,22.86 v24.13,22.86
RES  (via drill 0.61)
  Top 0.305: C2.1 38.1,26.67 35.88,28.89 31.43,28.89 30.48,29.84 19.37,29.84 v19.05,30.16 v12.38,36.83 12.33,36.88 R2.1 | v12.38,30.48 12.38,28.26 11.11,26.96 8.28,24.13 U3.RES | v29.21,50.8 28.88,50.49 U1.4 28.88,44.44 27.94,43.5 25.72,43.5 v25.4,43.18 | S1.1 49.85,62.55 48.9,63.5 v43.18,63.5
  Bottom 0.305: v12.38,30.48 v12.38,36.83 | v19.05,30.16 19.05,32.7 | 19.05,32.7 19.05,37.15 20.95,39.05 22.86,39.05 23.81,40.01 23.81,41.59 v25.4,43.18 | v29.21,50.8 28.89,51.12 28.89,60.64 27.62,62.23 | 27.62,62.23 J1.5 | 19.05,32.7 SJ2.1 | v43.18,63.5 28.89,63.5 27.62,62.23
V+  (via drill 0.61)
  Top 0.813: 35.56,20 35.33,20.23 U5.1 35.24,21.29 35.56,21.27 35.56,20 | 35.56,20 39.89,19.93 C4.A | v36.83,15.24 36.83,20 35.56,20
  Bottom 0.813: 32.7,16.51 32.38,16.83 13.02,16.83 8.89,12.7 JP5.2 | 34.92,16.51 35.24,16.83 v36.83,15.24
  Bottom 1.778: 32.7,16.51 34.92,16.51
VBAT
  Top 0.406: 17.46,18.73 16.69,18.73 arc45 16.55,18.81 U4.3 | 16.61,16.19 C8.2 | 16.61,16.19 16.46,16.19 | 16.61,16.19 arc45 16.44,16.12 16.46,16.03 | 16.46,10.58 arc45 16.27,12.79 JP2.2
  Top 0.61: 16.83,13.97 16.71,11.11 16.72,11.1
  Top 0.813: JP2.2 16.72,11.1 16.72,11 | 16.46,16.51 arc-45 16.64,16.44 C8.2 | 16.46,12.7 16.51,10.16 JP5.1
  Top 1.016: 16.62,18.49 arc-45 17.46,18.73
  Top 1.676: 16.46,16.19 16.46,18.41 17.14,18.47 arc-45 16.62,18.49 | 16.46,10.58 16.46,12.7 16.46,16.03
VUSB  (via drill 0.61)
  Top 0.305: X1.VBUS 29.83,7.79 29.69,8.1
  Top 0.406: LED1.A1 12.38,3.81 13.65,2.54 21.59,2.54 24.13,5.08 24.13,10.48 27.07,13.41 | C7.2 23.28,17.52 arc-90 23.18,17.3
  Top 0.508: U4.4 20.35,18.13 19.68,18.89 20.64,18.57 | C7.2 22.17,17.78
  Top 1.27: 22.94,17.54 23.18,17.3 | 22.94,17.54 23.15,17.86 arc45 23.65,17.93 v24.77,19.05 | 29.69,8.1 29.69,10.79 27.07,13.41 22.94,17.54
  Top 1.524: 20.64,18.57 21.27,17.78 22.17,17.78
  Bottom 1.27: U3.5V 8.57,29.21 9.84,27.94 9.84,24.45 13.97,20.32 23.18,20.64 v24.77,19.05

### Text on the board
tPlace: ICSP | TouScruino | RESET | v1 | RX | A5 | TX | A4 | RX2/D2 | A3 | TX2/D3 | A2 | ~D4 | A1 | ~D5 | A0 | ~D6 | ~D7 | GND | D8 | GND | D9 | 5V | BACK | LIGHT | D10 | 3.3V | MOSI | D11 | MISO | RESET | D12 | IOREF | SCK | D13 | D13 | GND | DTR | PROG | SDA | V+ | BAT | DTR | TX | RX | 3.3V | GND | GND | SCL | CHARGE | Arduino prog.